# EAGLE schematic scope (EAGLE 6.5.0)
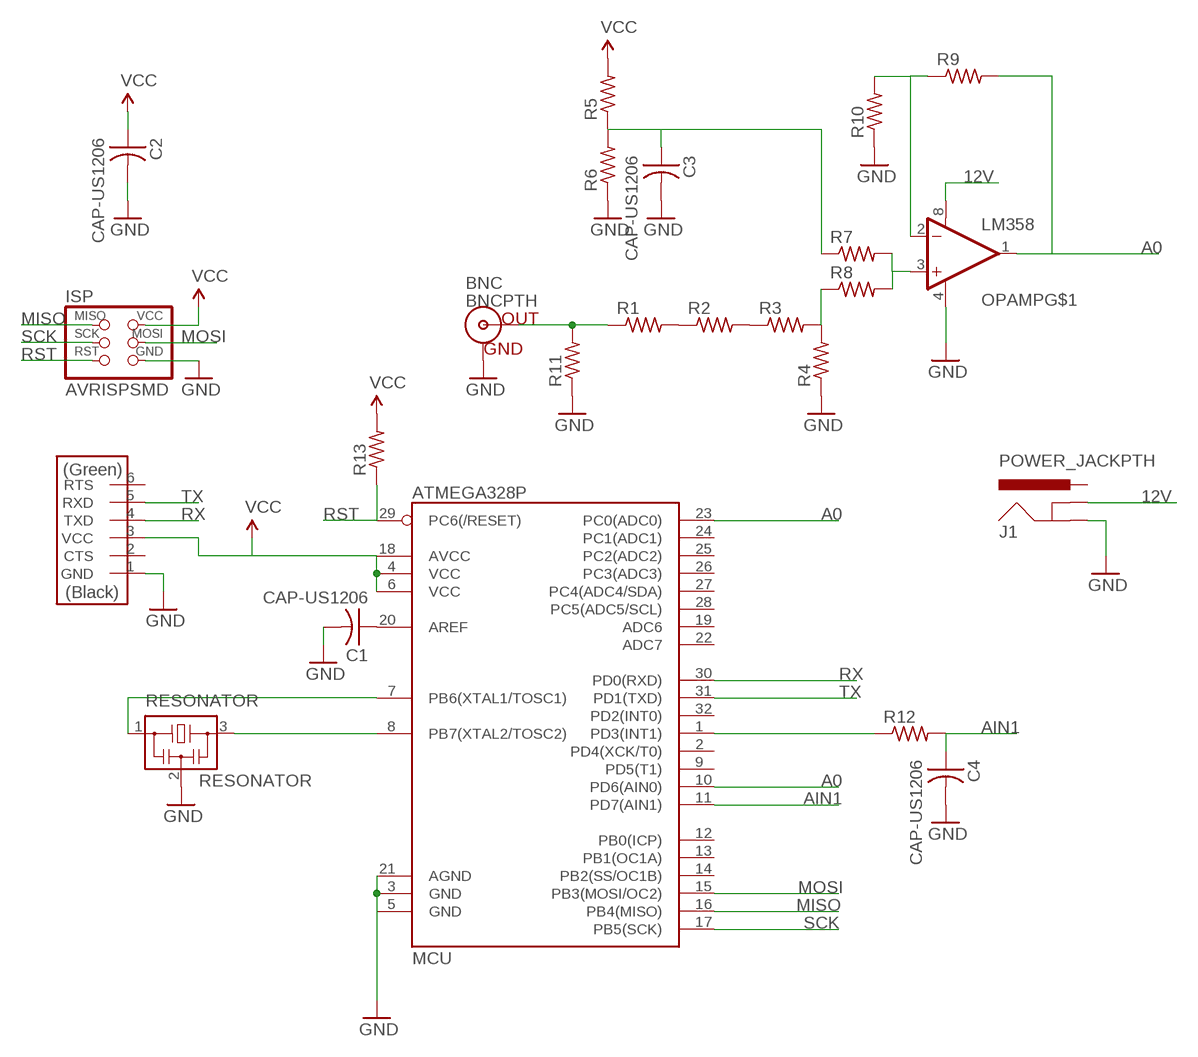
[diagram p0: schematic, sheet 1]

## Parts
BNC  BNCPTH  [BNC]
C1  CAP-US1206  [C1206]
C2  CAP-US1206  [C1206]
C3  CAP-US1206  [C1206]
C4  CAP-US1206  [C1206]
FTDI  FTDI-SMD-HEADER  [1X06SMD]
ISP  AVRISPSMD  [2X03SMD]
J1  POWER_JACKPTH  [POWER_JACK_PTH]
MCU  ATMEGA328P  ATMEGA328_SMT  [TQFP32-08]
OPAMP  LM358  [DIP08]
R1  RES-US1206  [R1206]
R2  RES-US1206  [R1206]
R3  RES-US1206  [R1206]
R4  RES-US1206  [R1206]
R5  RES-US1206  [R1206]
R6  RES-US1206  [R1206]
R7  RES-US1206  [R1206]
R8  RES-US1206  [R1206]
R9  RES-US1206  [R1206]
R10  RES-US1206  [R1206]
R11  RES-US1206  [R1206]
R12  RES-US1206  [R1206]
R13  RES-US1206  [R1206]
RESONATOR  RESONATOR  [EFOBM]

## Nets
12V: J1.GNDBREAK OPAMP.8(V+)
A0: MCU.10(PD6(AIN0)) MCU.23(PC0(ADC0)) OPAMP.1(OUT) R9.2
AIN1: C4.1 MCU.11(PD7(AIN1)) R12.2
GND: BNC.GND C1.2 C2.2 C3.2 C4.2 FTDI.1(GND) ISP.6(GND) J1.GND MCU.3(GND) MCU.5(GND) MCU.21(AGND) OPAMP.4(V-) R4.1 R6.1 R10.1 R11.1 RESONATOR.2
MISO: ISP.1(MISO) MCU.16(PB4(MISO))
MOSI: ISP.4(MOSI) MCU.15(PB3(MOSI/OC2))
N$1: MCU.7(PB6(XTAL1/TOSC1)) RESONATOR.1
N$2: MCU.8(PB7(XTAL2/TOSC2)) RESONATOR.3
N$3: BNC.S(OUT) R1.1 R11.2
N$4: C1.1 MCU.20(AREF)
N$5: R1.2 R2.1
N$6: R2.2 R3.1
N$7: R3.2 R4.2 R8.1
N$8: C3.1 R5.1 R6.2 R7.1
N$10: OPAMP.3(+IN) R7.2 R8.2
N$11: OPAMP.2(-IN) R9.1 R10.2
N$12: MCU.1(PD3(INT1)) R12.1
RST: ISP.5(RST) MCU.29(PC6(/RESET)) R13.1
RX: FTDI.4(TXD) MCU.30(PD0(RXD))
SCK: ISP.3(SCK) MCU.17(PB5(SCK))
TX: FTDI.5(RXD) MCU.31(PD1(TXD))
VCC: C2.1 FTDI.3(VCC) ISP.2(VCC) MCU.4(VCC) MCU.6(VCC) MCU.18(AVCC) R5.2 R13.2
Unconnected: FTDI.2(CTS) FTDI.6(RTS) J1.PWR MCU.2(PD4(XCK/T0)) MCU.9(PD5(T1)) MCU.12(PB0(ICP)) MCU.13(PB1(OC1A)) MCU.14(PB2(SS/OC1B)) MCU.19(ADC6) MCU.22(ADC7) MCU.24(PC1(ADC1)) MCU.25(PC2(ADC2)) MCU.26(PC3(ADC3)) MCU.27(PC4(ADC4/SDA)) MCU.28(PC5(ADC5/SCL)) MCU.32(PD2(INT0)) OPAMP.5(+IN) OPAMP.6(-IN) OPAMP.7(OUT)

## Library data of the parts
BNC = SparkFun-Connectors:BNC: BNC Connector, Mouser Part# 5227161
C1-C4 = fab:CAP-US
FTDI = fab:FTDI-SMD-HEADER
ISP = fab:AVRISP
J1 = SparkFun-Connectors:POWER_JACK: Power Jack This is the standard 5.5mm barrel jack for power. The PTH is the most common, proven, reliable, footprint. The Slot footprint only works if the mill layer is transmitted to the PCB fab house so be warned. Spark Fun Electronics SKU : PRT-00119 SMT: CONN-08106 Mating wall wart : TOL-00298 (and others)
MCU = SparkFun-DigitalIC:ATMEGA328_SMT: 32-Pin Atmega328 part Commonly used on Arduino compatible boards Available in QFP and QFN packages TQFP is IC-09069 QFN is non-stock; PROD_ID: IC-09069
OPAMP = SparkFun-AnalogIC:LM358: Jellybean op-amp
R1-R13 = fab:RES-US: Resistor (US Symbol) Variants with postfix FAB are widened to allow the routing of internal traces
RESONATOR = fab:RESONATOR